# Altium project Connection_board.PrjPcb
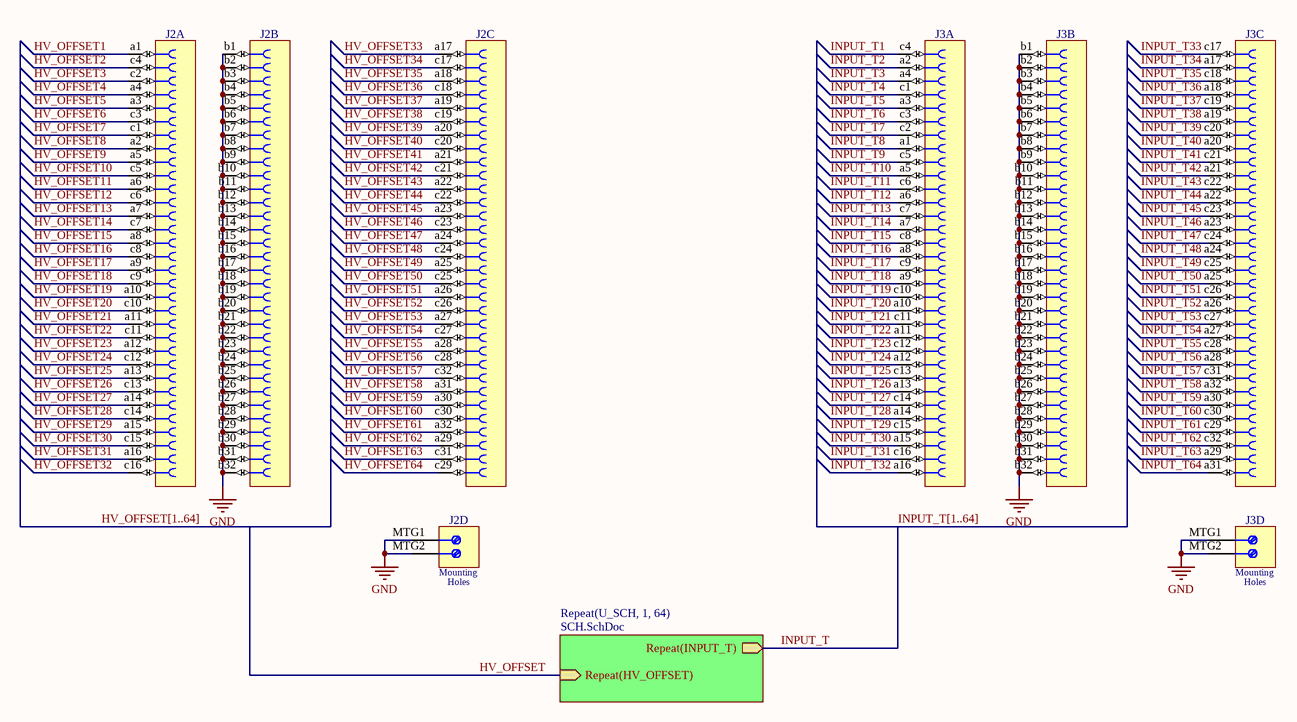
[diagram p0: Main.SchDoc]
2 sheets, 258 parts. Net scope: hierarchical (ports join the sheet entries above them; power ports are global).
Board file: PCB.PcbDoc
Sheets:
  Main.SchDoc
    U_SCH1 = SCH.SchDoc
    U_SCH2 = SCH.SchDoc
    U_SCH3 = SCH.SchDoc
    U_SCH4 = SCH.SchDoc
    U_SCH5 = SCH.SchDoc
    U_SCH6 = SCH.SchDoc
    U_SCH7 = SCH.SchDoc
    U_SCH8 = SCH.SchDoc
    U_SCH9 = SCH.SchDoc
    U_SCH10 = SCH.SchDoc
    U_SCH11 = SCH.SchDoc
    U_SCH12 = SCH.SchDoc
    U_SCH13 = SCH.SchDoc
    U_SCH14 = SCH.SchDoc
    U_SCH15 = SCH.SchDoc
    U_SCH16 = SCH.SchDoc
    U_SCH17 = SCH.SchDoc
    U_SCH18 = SCH.SchDoc
    U_SCH19 = SCH.SchDoc
    U_SCH20 = SCH.SchDoc
    U_SCH21 = SCH.SchDoc
    U_SCH22 = SCH.SchDoc
    U_SCH23 = SCH.SchDoc
    U_SCH24 = SCH.SchDoc
    U_SCH25 = SCH.SchDoc
    U_SCH26 = SCH.SchDoc
    U_SCH27 = SCH.SchDoc
    U_SCH28 = SCH.SchDoc
    U_SCH29 = SCH.SchDoc
    U_SCH30 = SCH.SchDoc
    U_SCH31 = SCH.SchDoc
    U_SCH32 = SCH.SchDoc
    U_SCH33 = SCH.SchDoc
    U_SCH34 = SCH.SchDoc
    U_SCH35 = SCH.SchDoc
    U_SCH36 = SCH.SchDoc
    U_SCH37 = SCH.SchDoc
    U_SCH38 = SCH.SchDoc
    U_SCH39 = SCH.SchDoc
    U_SCH40 = SCH.SchDoc
    U_SCH41 = SCH.SchDoc
    U_SCH42 = SCH.SchDoc
    U_SCH43 = SCH.SchDoc
    U_SCH44 = SCH.SchDoc
    U_SCH45 = SCH.SchDoc
    U_SCH46 = SCH.SchDoc
    U_SCH47 = SCH.SchDoc
    U_SCH48 = SCH.SchDoc
    U_SCH49 = SCH.SchDoc
    U_SCH50 = SCH.SchDoc
    U_SCH51 = SCH.SchDoc
    U_SCH52 = SCH.SchDoc
    U_SCH53 = SCH.SchDoc
    U_SCH54 = SCH.SchDoc
    U_SCH55 = SCH.SchDoc
    U_SCH56 = SCH.SchDoc
    U_SCH57 = SCH.SchDoc
    U_SCH58 = SCH.SchDoc
    U_SCH59 = SCH.SchDoc
    U_SCH60 = SCH.SchDoc
    U_SCH61 = SCH.SchDoc
    U_SCH62 = SCH.SchDoc
    U_SCH63 = SCH.SchDoc
    U_SCH64 = SCH.SchDoc

## Sheet Main.SchDoc
size A4

### Parts
J2  DIN 41612 Type C  [HARTING_09 03 296 6861]  (value not drawn)  (parts A,B,C,D of 4)
J3  DIN 41612 Type C  [HARTING_09 03 296 6861]  (value not drawn)  (parts A,B,C,D of 4)

### Sub-sheets
Repeat(U_SCH, 1, 64) = SCH.SchDoc: Repeat(INPUT_T) (out), Repeat(HV_OFFSET) (in)

### Nets
GND: J2.b1 J2.b2 J2.b3 J2.b4 J2.b5 J2.b6 J2.b7 J2.b8 J2.b9 J2.b10 J2.b11 J2.b12 J2.b13 J2.b14 J2.b15 J2.b16 J2.b17 J2.b18 J2.b19 J2.b20 J2.b21 J2.b22 J2.b23 J2.b24 J2.b25 J2.b26 J2.b27 J2.b28 J2.b29 J2.b30 J2.b31 J2.b32 J2.MTG1 J2.MTG2 J3.b1 J3.b2 J3.b3 J3.b4 J3.b5 J3.b6 J3.b7 J3.b8 J3.b9 J3.b10 J3.b11 J3.b12 J3.b13 J3.b14 J3.b15 J3.b16 J3.b17 J3.b18 J3.b19 J3.b20 J3.b21 J3.b22 J3.b23 J3.b24 J3.b25 J3.b26 J3.b27 J3.b28 J3.b29 J3.b30 J3.b31 J3.b32 J3.MTG1 J3.MTG2
HV_OFFSET: sheet Repeat(U_SCH, 1, 64)/Repeat(HV_OFFSET)
HV_OFFSET1: J2.a1
HV_OFFSET2: J2.c4
HV_OFFSET3: J2.c2
HV_OFFSET4: J2.a4
HV_OFFSET5: J2.a3
HV_OFFSET6: J2.c3
HV_OFFSET7: J2.c1
HV_OFFSET8: J2.a2
HV_OFFSET9: J2.a5
HV_OFFSET10: J2.c5
HV_OFFSET11: J2.a6
HV_OFFSET12: J2.c6
HV_OFFSET13: J2.a7
HV_OFFSET14: J2.c7
HV_OFFSET15: J2.a8
HV_OFFSET16: J2.c8
HV_OFFSET17: J2.a9
HV_OFFSET18: J2.c9
HV_OFFSET19: J2.a10
HV_OFFSET20: J2.c10
HV_OFFSET21: J2.a11
HV_OFFSET22: J2.c11
HV_OFFSET23: J2.a12
HV_OFFSET24: J2.c12
HV_OFFSET25: J2.a13
HV_OFFSET26: J2.c13
HV_OFFSET27: J2.a14
HV_OFFSET28: J2.c14
HV_OFFSET29: J2.a15
HV_OFFSET30: J2.c15
HV_OFFSET31: J2.a16
HV_OFFSET32: J2.c16
HV_OFFSET33: J2.a17
HV_OFFSET34: J2.c17
HV_OFFSET35: J2.a18
HV_OFFSET36: J2.c18
HV_OFFSET37: J2.a19
HV_OFFSET38: J2.c19
HV_OFFSET39: J2.a20
HV_OFFSET40: J2.c20
HV_OFFSET41: J2.a21
HV_OFFSET42: J2.c21
HV_OFFSET43: J2.a22
HV_OFFSET44: J2.c22
HV_OFFSET45: J2.a23
HV_OFFSET46: J2.c23
HV_OFFSET47: J2.a24
HV_OFFSET48: J2.c24
HV_OFFSET49: J2.a25
HV_OFFSET50: J2.c25
HV_OFFSET51: J2.a26
HV_OFFSET52: J2.c26
HV_OFFSET53: J2.a27
HV_OFFSET54: J2.c27
HV_OFFSET55: J2.a28
HV_OFFSET56: J2.c28
HV_OFFSET57: J2.c32
HV_OFFSET58: J2.a31
HV_OFFSET59: J2.a30
HV_OFFSET60: J2.c30
HV_OFFSET61: J2.a32
HV_OFFSET62: J2.a29
HV_OFFSET63: J2.c31
HV_OFFSET64: J2.c29
INPUT_T: sheet Repeat(U_SCH, 1, 64)/Repeat(INPUT_T)
INPUT_T1: J3.c4
INPUT_T2: J3.a2
INPUT_T3: J3.a4
INPUT_T4: J3.c1
INPUT_T5: J3.a3
INPUT_T6: J3.c3
INPUT_T7: J3.c2
INPUT_T8: J3.a1
INPUT_T9: J3.c5
INPUT_T10: J3.a5
INPUT_T11: J3.c6
INPUT_T12: J3.a6
INPUT_T13: J3.c7
INPUT_T14: J3.a7
INPUT_T15: J3.c8
INPUT_T16: J3.a8
INPUT_T17: J3.c9
INPUT_T18: J3.a9
INPUT_T19: J3.c10
INPUT_T20: J3.a10
INPUT_T21: J3.c11
INPUT_T22: J3.a11
INPUT_T23: J3.c12
INPUT_T24: J3.a12
INPUT_T25: J3.c13
INPUT_T26: J3.a13
INPUT_T27: J3.c14
INPUT_T28: J3.a14
INPUT_T29: J3.c15
INPUT_T30: J3.a15
INPUT_T31: J3.c16
INPUT_T32: J3.a16
INPUT_T33: J3.c17
INPUT_T34: J3.a17
INPUT_T35: J3.c18
INPUT_T36: J3.a18
INPUT_T37: J3.c19
INPUT_T38: J3.a19
INPUT_T39: J3.c20
INPUT_T40: J3.a20
INPUT_T41: J3.c21
INPUT_T42: J3.a21
INPUT_T43: J3.c22
INPUT_T44: J3.a22
INPUT_T45: J3.c23
INPUT_T46: J3.a23
INPUT_T47: J3.c24
INPUT_T48: J3.a24
INPUT_T49: J3.c25
INPUT_T50: J3.a25
INPUT_T51: J3.c26
INPUT_T52: J3.a26
INPUT_T53: J3.c27
INPUT_T54: J3.a27
INPUT_T55: J3.c28
INPUT_T56: J3.a28
INPUT_T57: J3.c31
INPUT_T58: J3.a32
INPUT_T59: J3.a30
INPUT_T60: J3.c30
INPUT_T61: J3.c29
INPUT_T62: J3.c32
INPUT_T63: J3.a29
INPUT_T64: J3.a31

### Buses and harness runs
bus HV_OFFSET[1..64]
bus INPUT_T[1..64]

### Notes on the sheet
- (in symbol HARTING_09 03 296 6861, part D) Mounting; Holes

### Library data of the parts
J2 J3 = HARTING_09 03 296 6861: Connector 96abc Female (3x32); Part Description: DIN 41612, Type C, 96 Position, Rows a+b+c, Performance level 2, Press-in Lead Lead 13mm, Pitch 2.54mm, Straight Female Connector; Part Number: HARTING_09 03 296 6861; Component Kind: Standard; Component Type: Standard; Pin Count: 98; Family: DIN 41612 Type C; Mounted: Yes; Socket: No; SMD: No; PressFit: Yes; Sense: No; Status: None; Manufacturer: HARTING; Manufacturer Part Number: 09 03 296 6861; ComponentHeight: 11.6mm; HelpURL: \\cern.ch\dfs\Applications\Altium\Datasheets\HARTING_09 03 296 6861.pdf; Author: CERN DEM JLC; CreateDate: 19.12.2016; LatestRevisionDate: 19.12.2016

## Sheet SCH.SchDoc
size A4
Used 64 times, as channels U_SCH1, U_SCH2, U_SCH3, U_SCH4, U_SCH5, U_SCH6, U_SCH7, U_SCH8, U_SCH9, U_SCH10, U_SCH11, U_SCH12, U_SCH13, U_SCH14, U_SCH15, U_SCH16, U_SCH17, U_SCH18, U_SCH19, U_SCH20, U_SCH21, U_SCH22, U_SCH23, U_SCH24, U_SCH25, U_SCH26, U_SCH27, U_SCH28, U_SCH29, U_SCH30, U_SCH31, U_SCH32, U_SCH33, U_SCH34, U_SCH35, U_SCH36, U_SCH37, U_SCH38, U_SCH39, U_SCH40, U_SCH41, U_SCH42, U_SCH43, U_SCH44, U_SCH45, U_SCH46, U_SCH47, U_SCH48, U_SCH49, U_SCH50, U_SCH51, U_SCH52, U_SCH53, U_SCH54, U_SCH55, U_SCH56, U_SCH57, U_SCH58, U_SCH59, U_SCH60, U_SCH61, U_SCH62, U_SCH63, U_SCH64. Parts and nets are listed once, with the designators drawn on the sheet.
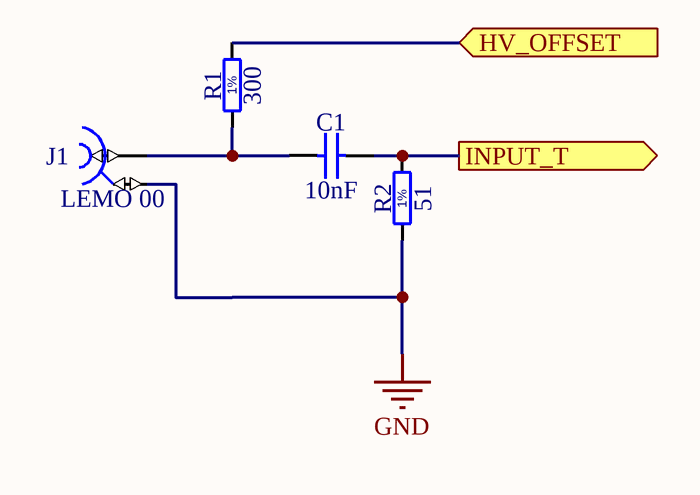
[diagram p1: SCH.SchDoc]

### Parts
C1  10nF  [CAPC2012X135N]
J1  LEMO 00  [LEMO_EPA.00.250.NTN]
R1  300  [RESC2012X60N]
R2  51  [RESC2012X60N]

### Ports
HV_OFFSET (in), INPUT_T (out)

### Nets
GND: J1.2 R2.1
HV_OFFSET: R1.2 ; port HV_OFFSET
INPUT_T: C1.2 R2.2 ; port INPUT_T
NetC1_1: C1.1 J1.1 R1.1

### Channels
U_SCH1: designators end in _U_SCH1; ports HV_OFFSET=HV_OFFSET1 INPUT_T=INPUT_T1
U_SCH2: designators end in _U_SCH2; ports HV_OFFSET=HV_OFFSET2 INPUT_T=INPUT_T2
U_SCH3: designators end in _U_SCH3; ports HV_OFFSET=HV_OFFSET3 INPUT_T=INPUT_T3
U_SCH4: designators end in _U_SCH4; ports HV_OFFSET=HV_OFFSET4 INPUT_T=INPUT_T4
U_SCH5: designators end in _U_SCH5; ports HV_OFFSET=HV_OFFSET5 INPUT_T=INPUT_T5
U_SCH6: designators end in _U_SCH6; ports HV_OFFSET=HV_OFFSET6 INPUT_T=INPUT_T6
U_SCH7: designators end in _U_SCH7; ports HV_OFFSET=HV_OFFSET7 INPUT_T=INPUT_T7
U_SCH8: designators end in _U_SCH8; ports HV_OFFSET=HV_OFFSET8 INPUT_T=INPUT_T8
U_SCH9: designators end in _U_SCH9; ports HV_OFFSET=HV_OFFSET9 INPUT_T=INPUT_T9
U_SCH10: designators end in _U_SCH10; ports HV_OFFSET=HV_OFFSET10 INPUT_T=INPUT_T10
U_SCH11: designators end in _U_SCH11; ports HV_OFFSET=HV_OFFSET11 INPUT_T=INPUT_T11
U_SCH12: designators end in _U_SCH12; ports HV_OFFSET=HV_OFFSET12 INPUT_T=INPUT_T12
U_SCH13: designators end in _U_SCH13; ports HV_OFFSET=HV_OFFSET13 INPUT_T=INPUT_T13
U_SCH14: designators end in _U_SCH14; ports HV_OFFSET=HV_OFFSET14 INPUT_T=INPUT_T14
U_SCH15: designators end in _U_SCH15; ports HV_OFFSET=HV_OFFSET15 INPUT_T=INPUT_T15
U_SCH16: designators end in _U_SCH16; ports HV_OFFSET=HV_OFFSET16 INPUT_T=INPUT_T16
U_SCH17: designators end in _U_SCH17; ports HV_OFFSET=HV_OFFSET17 INPUT_T=INPUT_T17
U_SCH18: designators end in _U_SCH18; ports HV_OFFSET=HV_OFFSET18 INPUT_T=INPUT_T18
U_SCH19: designators end in _U_SCH19; ports HV_OFFSET=HV_OFFSET19 INPUT_T=INPUT_T19
U_SCH20: designators end in _U_SCH20; ports HV_OFFSET=HV_OFFSET20 INPUT_T=INPUT_T20
U_SCH21: designators end in _U_SCH21; ports HV_OFFSET=HV_OFFSET21 INPUT_T=INPUT_T21
U_SCH22: designators end in _U_SCH22; ports HV_OFFSET=HV_OFFSET22 INPUT_T=INPUT_T22
U_SCH23: designators end in _U_SCH23; ports HV_OFFSET=HV_OFFSET23 INPUT_T=INPUT_T23
U_SCH24: designators end in _U_SCH24; ports HV_OFFSET=HV_OFFSET24 INPUT_T=INPUT_T24
U_SCH25: designators end in _U_SCH25; ports HV_OFFSET=HV_OFFSET25 INPUT_T=INPUT_T25
U_SCH26: designators end in _U_SCH26; ports HV_OFFSET=HV_OFFSET26 INPUT_T=INPUT_T26
U_SCH27: designators end in _U_SCH27; ports HV_OFFSET=HV_OFFSET27 INPUT_T=INPUT_T27
U_SCH28: designators end in _U_SCH28; ports HV_OFFSET=HV_OFFSET28 INPUT_T=INPUT_T28
U_SCH29: designators end in _U_SCH29; ports HV_OFFSET=HV_OFFSET29 INPUT_T=INPUT_T29
U_SCH30: designators end in _U_SCH30; ports HV_OFFSET=HV_OFFSET30 INPUT_T=INPUT_T30
U_SCH31: designators end in _U_SCH31; ports HV_OFFSET=HV_OFFSET31 INPUT_T=INPUT_T31
U_SCH32: designators end in _U_SCH32; ports HV_OFFSET=HV_OFFSET32 INPUT_T=INPUT_T32
U_SCH33: designators end in _U_SCH33; ports HV_OFFSET=HV_OFFSET33 INPUT_T=INPUT_T33
U_SCH34: designators end in _U_SCH34; ports HV_OFFSET=HV_OFFSET34 INPUT_T=INPUT_T34
U_SCH35: designators end in _U_SCH35; ports HV_OFFSET=HV_OFFSET35 INPUT_T=INPUT_T35
U_SCH36: designators end in _U_SCH36; ports HV_OFFSET=HV_OFFSET36 INPUT_T=INPUT_T36
U_SCH37: designators end in _U_SCH37; ports HV_OFFSET=HV_OFFSET37 INPUT_T=INPUT_T37
U_SCH38: designators end in _U_SCH38; ports HV_OFFSET=HV_OFFSET38 INPUT_T=INPUT_T38
U_SCH39: designators end in _U_SCH39; ports HV_OFFSET=HV_OFFSET39 INPUT_T=INPUT_T39
U_SCH40: designators end in _U_SCH40; ports HV_OFFSET=HV_OFFSET40 INPUT_T=INPUT_T40
U_SCH41: designators end in _U_SCH41; ports HV_OFFSET=HV_OFFSET41 INPUT_T=INPUT_T41
U_SCH42: designators end in _U_SCH42; ports HV_OFFSET=HV_OFFSET42 INPUT_T=INPUT_T42
U_SCH43: designators end in _U_SCH43; ports HV_OFFSET=HV_OFFSET43 INPUT_T=INPUT_T43
U_SCH44: designators end in _U_SCH44; ports HV_OFFSET=HV_OFFSET44 INPUT_T=INPUT_T44
U_SCH45: designators end in _U_SCH45; ports HV_OFFSET=HV_OFFSET45 INPUT_T=INPUT_T45
U_SCH46: designators end in _U_SCH46; ports HV_OFFSET=HV_OFFSET46 INPUT_T=INPUT_T46
U_SCH47: designators end in _U_SCH47; ports HV_OFFSET=HV_OFFSET47 INPUT_T=INPUT_T47
U_SCH48: designators end in _U_SCH48; ports HV_OFFSET=HV_OFFSET48 INPUT_T=INPUT_T48
U_SCH49: designators end in _U_SCH49; ports HV_OFFSET=HV_OFFSET49 INPUT_T=INPUT_T49
U_SCH50: designators end in _U_SCH50; ports HV_OFFSET=HV_OFFSET50 INPUT_T=INPUT_T50
U_SCH51: designators end in _U_SCH51; ports HV_OFFSET=HV_OFFSET51 INPUT_T=INPUT_T51
U_SCH52: designators end in _U_SCH52; ports HV_OFFSET=HV_OFFSET52 INPUT_T=INPUT_T52
U_SCH53: designators end in _U_SCH53; ports HV_OFFSET=HV_OFFSET53 INPUT_T=INPUT_T53
U_SCH54: designators end in _U_SCH54; ports HV_OFFSET=HV_OFFSET54 INPUT_T=INPUT_T54
U_SCH55: designators end in _U_SCH55; ports HV_OFFSET=HV_OFFSET55 INPUT_T=INPUT_T55
U_SCH56: designators end in _U_SCH56; ports HV_OFFSET=HV_OFFSET56 INPUT_T=INPUT_T56
U_SCH57: designators end in _U_SCH57; ports HV_OFFSET=HV_OFFSET57 INPUT_T=INPUT_T57
U_SCH58: designators end in _U_SCH58; ports HV_OFFSET=HV_OFFSET58 INPUT_T=INPUT_T58
U_SCH59: designators end in _U_SCH59; ports HV_OFFSET=HV_OFFSET59 INPUT_T=INPUT_T59
U_SCH60: designators end in _U_SCH60; ports HV_OFFSET=HV_OFFSET60 INPUT_T=INPUT_T60
U_SCH61: designators end in _U_SCH61; ports HV_OFFSET=HV_OFFSET61 INPUT_T=INPUT_T61
U_SCH62: designators end in _U_SCH62; ports HV_OFFSET=HV_OFFSET62 INPUT_T=INPUT_T62
U_SCH63: designators end in _U_SCH63; ports HV_OFFSET=HV_OFFSET63 INPUT_T=INPUT_T63
U_SCH64: designators end in _U_SCH64; ports HV_OFFSET=HV_OFFSET64 INPUT_T=INPUT_T64

### Notes on the sheet
- (in symbol R0805_51R_1%_0.125W_100PPM) 1%
- (in symbol R0805_300R_1%_0.125W_100PPM) 1%

### Library data of the parts
C1 = CC0805_10NF_50V_10%_X7R: Non-polarised capacitor; Part Description: SMD Multilayer Chip Ceramic Capacitor; Manufacturer: GENERIC; Manufacturer1 Part Number: C0805C103K5RACTU; Voltage: 50V; TC: X7R; Tolerance: ±10%; Part Number: CC0805_10NF_50V_10%_X7R; Component Kind: Standard; Component Type: Standard; Pin Count: 2; Value: 10nF; Status: Preferred; Manufacturer Part Number: CC0805_10NF_50V_10%_X7R; Case: 0805; Mounted: Yes; Socket: No; SMD: Yes; Sense: No; Manufacturer1 Example: KEMET; Manufacturer1 ComponentHeight: 0.88mm; HelpURL: \\cern.ch\dfs\Applications\Altium\Datasheets\CC0805_X7R_KEMET.pdf; Author: CERN DEM JLC; CreateDate: 03.12.2007; LatestRevisionDate: 22.04.2015
J1 = LEMO_EPA.00.250.NTN: Part Description: Size 00, 50 Ohms Coaxial Straight socket; PressFit: No; SCEM: 09.46.11.184.2; Part Number: LEMO_EPA.00.250.NTN; Component Kind: Standard; Component Type: Standard; Pin Count: 2; Family: LEMO 00; Mounted: Yes; Socket: No; SMD: No; Sense: No; Status: None; Manufacturer: LEMO; Manufacturer Part Number: EPA.00.250.NTN; ComponentHeight: 14mm; HelpURL: \\cern.ch\dfs\Applications\Altium\Datasheets\LEMO_EPA.00.250.NTN.pdf; Author: CERN DEM JLC; CreateDate: 22.04.2008; LatestRevisionDate: 22.04.2008
R1 = R0805_300R_1%_0.125W_100PPM: Resistor - 1%; Part Description: General Purpose Thick Film Chip Resistor; Manufacturer: GENERIC; Manufacturer1 Part Number: NRC10F3000TRF; Power: 0.125W; TC: ±100ppm/°C; PressFit: No; Part Number: R0805_300R_1%_0.125W_100PPM; Component Kind: Standard; Component Type: Standard; Pin Count: 2; Value: 300; Status: Preferred; Tolerance: ±1%; Manufacturer Part Number: R0805_300R_1%_0.125W_100PPM; Case: 0805; Mounted: Yes; Sense: No; Socket: No; SMD: Yes; Manufacturer1 Example: NIC COMPONENT; Manufacturer1 ComponentHeight: 0.6mm; HelpURL: \\cern.ch\dfs\Applications\Altium\Datasheets\R0805_NIC_NRC.pdf; Author: CERN DEM JLC; CreateDate: 03.12.2007; LatestRevisionDate: 13.03.2008
R2 = R0805_51R_1%_0.125W_100PPM: Resistor - 1%; Part Description: General Purpose Thick Film Chip Resistor; Manufacturer: GENERIC; Manufacturer1 Part Number: NRC10F51R0TRF; Power: 0.125W; TC: ±100ppm/°C; PressFit: No; Part Number: R0805_51R_1%_0.125W_100PPM; Component Kind: Standard; Component Type: Standard; Pin Count: 2; Value: 51; Status: Preferred; Tolerance: ±1%; Manufacturer Part Number: R0805_51R_1%_0.125W_100PPM; Case: 0805; Mounted: Yes; Sense: No; Socket: No; SMD: Yes; Manufacturer1 Example: NIC COMPONENT; Manufacturer1 ComponentHeight: 0.6mm; HelpURL: \\cern.ch\dfs\Applications\Altium\Datasheets\R0805_NIC_NRC.pdf; Author: CERN DEM JLC; CreateDate: 03.12.2007; LatestRevisionDate: 13.03.2008

## Nets that join several sheets
GND: Main (68 pins), U_SCH1 (J1_U_SCH1.2 R2_U_SCH1.1), U_SCH2 (J1_U_SCH2.2 R2_U_SCH2.1), U_SCH3 (J1_U_SCH3.2 R2_U_SCH3.1), U_SCH4 (J1_U_SCH4.2 R2_U_SCH4.1), U_SCH5 (J1_U_SCH5.2 R2_U_SCH5.1), U_SCH6 (J1_U_SCH6.2 R2_U_SCH6.1), U_SCH7 (J1_U_SCH7.2 R2_U_SCH7.1), U_SCH8 (J1_U_SCH8.2 R2_U_SCH8.1), U_SCH9 (J1_U_SCH9.2 R2_U_SCH9.1), U_SCH10 (J1_U_SCH10.2 R2_U_SCH10.1), U_SCH11 (J1_U_SCH11.2 R2_U_SCH11.1), U_SCH12 (J1_U_SCH12.2 R2_U_SCH12.1), U_SCH13 (J1_U_SCH13.2 R2_U_SCH13.1), U_SCH14 (J1_U_SCH14.2 R2_U_SCH14.1), U_SCH15 (J1_U_SCH15.2 R2_U_SCH15.1), U_SCH16 (J1_U_SCH16.2 R2_U_SCH16.1), U_SCH17 (J1_U_SCH17.2 R2_U_SCH17.1), U_SCH18 (J1_U_SCH18.2 R2_U_SCH18.1), U_SCH19 (J1_U_SCH19.2 R2_U_SCH19.1), U_SCH20 (J1_U_SCH20.2 R2_U_SCH20.1), U_SCH21 (J1_U_SCH21.2 R2_U_SCH21.1), U_SCH22 (J1_U_SCH22.2 R2_U_SCH22.1), U_SCH23 (J1_U_SCH23.2 R2_U_SCH23.1), U_SCH24 (J1_U_SCH24.2 R2_U_SCH24.1), U_SCH25 (J1_U_SCH25.2 R2_U_SCH25.1), U_SCH26 (J1_U_SCH26.2 R2_U_SCH26.1), U_SCH27 (J1_U_SCH27.2 R2_U_SCH27.1), U_SCH28 (J1_U_SCH28.2 R2_U_SCH28.1), U_SCH29 (J1_U_SCH29.2 R2_U_SCH29.1), U_SCH30 (J1_U_SCH30.2 R2_U_SCH30.1), U_SCH31 (J1_U_SCH31.2 R2_U_SCH31.1), U_SCH32 (J1_U_SCH32.2 R2_U_SCH32.1), U_SCH33 (J1_U_SCH33.2 R2_U_SCH33.1), U_SCH34 (J1_U_SCH34.2 R2_U_SCH34.1), U_SCH35 (J1_U_SCH35.2 R2_U_SCH35.1), U_SCH36 (J1_U_SCH36.2 R2_U_SCH36.1), U_SCH37 (J1_U_SCH37.2 R2_U_SCH37.1), U_SCH38 (J1_U_SCH38.2 R2_U_SCH38.1), U_SCH39 (J1_U_SCH39.2 R2_U_SCH39.1), U_SCH40 (J1_U_SCH40.2 R2_U_SCH40.1), U_SCH41 (J1_U_SCH41.2 R2_U_SCH41.1), U_SCH42 (J1_U_SCH42.2 R2_U_SCH42.1), U_SCH43 (J1_U_SCH43.2 R2_U_SCH43.1), U_SCH44 (J1_U_SCH44.2 R2_U_SCH44.1), U_SCH45 (J1_U_SCH45.2 R2_U_SCH45.1), U_SCH46 (J1_U_SCH46.2 R2_U_SCH46.1), U_SCH47 (J1_U_SCH47.2 R2_U_SCH47.1), U_SCH48 (J1_U_SCH48.2 R2_U_SCH48.1), U_SCH49 (J1_U_SCH49.2 R2_U_SCH49.1), U_SCH50 (J1_U_SCH50.2 R2_U_SCH50.1), U_SCH51 (J1_U_SCH51.2 R2_U_SCH51.1), U_SCH52 (J1_U_SCH52.2 R2_U_SCH52.1), U_SCH53 (J1_U_SCH53.2 R2_U_SCH53.1), U_SCH54 (J1_U_SCH54.2 R2_U_SCH54.1), U_SCH55 (J1_U_SCH55.2 R2_U_SCH55.1), U_SCH56 (J1_U_SCH56.2 R2_U_SCH56.1), U_SCH57 (J1_U_SCH57.2 R2_U_SCH57.1), U_SCH58 (J1_U_SCH58.2 R2_U_SCH58.1), U_SCH59 (J1_U_SCH59.2 R2_U_SCH59.1), U_SCH60 (J1_U_SCH60.2 R2_U_SCH60.1), U_SCH61 (J1_U_SCH61.2 R2_U_SCH61.1), U_SCH62 (J1_U_SCH62.2 R2_U_SCH62.1), U_SCH63 (J1_U_SCH63.2 R2_U_SCH63.1), U_SCH64 (J1_U_SCH64.2 R2_U_SCH64.1)
HV_OFFSET1: Main (J2.a1), U_SCH1 (R1_U_SCH1.2)
HV_OFFSET2: Main (J2.c4), U_SCH2 (R1_U_SCH2.2)
HV_OFFSET3: Main (J2.c2), U_SCH3 (R1_U_SCH3.2)
HV_OFFSET4: Main (J2.a4), U_SCH4 (R1_U_SCH4.2)
HV_OFFSET5: Main (J2.a3), U_SCH5 (R1_U_SCH5.2)
HV_OFFSET6: Main (J2.c3), U_SCH6 (R1_U_SCH6.2)
HV_OFFSET7: Main (J2.c1), U_SCH7 (R1_U_SCH7.2)
HV_OFFSET8: Main (J2.a2), U_SCH8 (R1_U_SCH8.2)
HV_OFFSET9: Main (J2.a5), U_SCH9 (R1_U_SCH9.2)
HV_OFFSET10: Main (J2.c5), U_SCH10 (R1_U_SCH10.2)
HV_OFFSET11: Main (J2.a6), U_SCH11 (R1_U_SCH11.2)
HV_OFFSET12: Main (J2.c6), U_SCH12 (R1_U_SCH12.2)
HV_OFFSET13: Main (J2.a7), U_SCH13 (R1_U_SCH13.2)
HV_OFFSET14: Main (J2.c7), U_SCH14 (R1_U_SCH14.2)
HV_OFFSET15: Main (J2.a8), U_SCH15 (R1_U_SCH15.2)
HV_OFFSET16: Main (J2.c8), U_SCH16 (R1_U_SCH16.2)
HV_OFFSET17: Main (J2.a9), U_SCH17 (R1_U_SCH17.2)
HV_OFFSET18: Main (J2.c9), U_SCH18 (R1_U_SCH18.2)
HV_OFFSET19: Main (J2.a10), U_SCH19 (R1_U_SCH19.2)
HV_OFFSET20: Main (J2.c10), U_SCH20 (R1_U_SCH20.2)
HV_OFFSET21: Main (J2.a11), U_SCH21 (R1_U_SCH21.2)
HV_OFFSET22: Main (J2.c11), U_SCH22 (R1_U_SCH22.2)
HV_OFFSET23: Main (J2.a12), U_SCH23 (R1_U_SCH23.2)
HV_OFFSET24: Main (J2.c12), U_SCH24 (R1_U_SCH24.2)
HV_OFFSET25: Main (J2.a13), U_SCH25 (R1_U_SCH25.2)
HV_OFFSET26: Main (J2.c13), U_SCH26 (R1_U_SCH26.2)
HV_OFFSET27: Main (J2.a14), U_SCH27 (R1_U_SCH27.2)
HV_OFFSET28: Main (J2.c14), U_SCH28 (R1_U_SCH28.2)
HV_OFFSET29: Main (J2.a15), U_SCH29 (R1_U_SCH29.2)
HV_OFFSET30: Main (J2.c15), U_SCH30 (R1_U_SCH30.2)
HV_OFFSET31: Main (J2.a16), U_SCH31 (R1_U_SCH31.2)
HV_OFFSET32: Main (J2.c16), U_SCH32 (R1_U_SCH32.2)
HV_OFFSET33: Main (J2.a17), U_SCH33 (R1_U_SCH33.2)
HV_OFFSET34: Main (J2.c17), U_SCH34 (R1_U_SCH34.2)
HV_OFFSET35: Main (J2.a18), U_SCH35 (R1_U_SCH35.2)
HV_OFFSET36: Main (J2.c18), U_SCH36 (R1_U_SCH36.2)
HV_OFFSET37: Main (J2.a19), U_SCH37 (R1_U_SCH37.2)
HV_OFFSET38: Main (J2.c19), U_SCH38 (R1_U_SCH38.2)
HV_OFFSET39: Main (J2.a20), U_SCH39 (R1_U_SCH39.2)
HV_OFFSET40: Main (J2.c20), U_SCH40 (R1_U_SCH40.2)
HV_OFFSET41: Main (J2.a21), U_SCH41 (R1_U_SCH41.2)
HV_OFFSET42: Main (J2.c21), U_SCH42 (R1_U_SCH42.2)
HV_OFFSET43: Main (J2.a22), U_SCH43 (R1_U_SCH43.2)
HV_OFFSET44: Main (J2.c22), U_SCH44 (R1_U_SCH44.2)
HV_OFFSET45: Main (J2.a23), U_SCH45 (R1_U_SCH45.2)
HV_OFFSET46: Main (J2.c23), U_SCH46 (R1_U_SCH46.2)
HV_OFFSET47: Main (J2.a24), U_SCH47 (R1_U_SCH47.2)
HV_OFFSET48: Main (J2.c24), U_SCH48 (R1_U_SCH48.2)
HV_OFFSET49: Main (J2.a25), U_SCH49 (R1_U_SCH49.2)
HV_OFFSET50: Main (J2.c25), U_SCH50 (R1_U_SCH50.2)
HV_OFFSET51: Main (J2.a26), U_SCH51 (R1_U_SCH51.2)
HV_OFFSET52: Main (J2.c26), U_SCH52 (R1_U_SCH52.2)
HV_OFFSET53: Main (J2.a27), U_SCH53 (R1_U_SCH53.2)
HV_OFFSET54: Main (J2.c27), U_SCH54 (R1_U_SCH54.2)
HV_OFFSET55: Main (J2.a28), U_SCH55 (R1_U_SCH55.2)
HV_OFFSET56: Main (J2.c28), U_SCH56 (R1_U_SCH56.2)
HV_OFFSET57: Main (J2.c32), U_SCH57 (R1_U_SCH57.2)
HV_OFFSET58: Main (J2.a31), U_SCH58 (R1_U_SCH58.2)
HV_OFFSET59: Main (J2.a30), U_SCH59 (R1_U_SCH59.2)
HV_OFFSET60: Main (J2.c30), U_SCH60 (R1_U_SCH60.2)
HV_OFFSET61: Main (J2.a32), U_SCH61 (R1_U_SCH61.2)
HV_OFFSET62: Main (J2.a29), U_SCH62 (R1_U_SCH62.2)
HV_OFFSET63: Main (J2.c31), U_SCH63 (R1_U_SCH63.2)
HV_OFFSET64: Main (J2.c29), U_SCH64 (R1_U_SCH64.2)
INPUT_T1: Main (J3.c4), U_SCH1 (C1_U_SCH1.2 R2_U_SCH1.2)
INPUT_T2: Main (J3.a2), U_SCH2 (C1_U_SCH2.2 R2_U_SCH2.2)
INPUT_T3: Main (J3.a4), U_SCH3 (C1_U_SCH3.2 R2_U_SCH3.2)
INPUT_T4: Main (J3.c1), U_SCH4 (C1_U_SCH4.2 R2_U_SCH4.2)
INPUT_T5: Main (J3.a3), U_SCH5 (C1_U_SCH5.2 R2_U_SCH5.2)
INPUT_T6: Main (J3.c3), U_SCH6 (C1_U_SCH6.2 R2_U_SCH6.2)
INPUT_T7: Main (J3.c2), U_SCH7 (C1_U_SCH7.2 R2_U_SCH7.2)
INPUT_T8: Main (J3.a1), U_SCH8 (C1_U_SCH8.2 R2_U_SCH8.2)
INPUT_T9: Main (J3.c5), U_SCH9 (C1_U_SCH9.2 R2_U_SCH9.2)
INPUT_T10: Main (J3.a5), U_SCH10 (C1_U_SCH10.2 R2_U_SCH10.2)
INPUT_T11: Main (J3.c6), U_SCH11 (C1_U_SCH11.2 R2_U_SCH11.2)
INPUT_T12: Main (J3.a6), U_SCH12 (C1_U_SCH12.2 R2_U_SCH12.2)
INPUT_T13: Main (J3.c7), U_SCH13 (C1_U_SCH13.2 R2_U_SCH13.2)
INPUT_T14: Main (J3.a7), U_SCH14 (C1_U_SCH14.2 R2_U_SCH14.2)
INPUT_T15: Main (J3.c8), U_SCH15 (C1_U_SCH15.2 R2_U_SCH15.2)
INPUT_T16: Main (J3.a8), U_SCH16 (C1_U_SCH16.2 R2_U_SCH16.2)
INPUT_T17: Main (J3.c9), U_SCH17 (C1_U_SCH17.2 R2_U_SCH17.2)
INPUT_T18: Main (J3.a9), U_SCH18 (C1_U_SCH18.2 R2_U_SCH18.2)
INPUT_T19: Main (J3.c10), U_SCH19 (C1_U_SCH19.2 R2_U_SCH19.2)
INPUT_T20: Main (J3.a10), U_SCH20 (C1_U_SCH20.2 R2_U_SCH20.2)
INPUT_T21: Main (J3.c11), U_SCH21 (C1_U_SCH21.2 R2_U_SCH21.2)
INPUT_T22: Main (J3.a11), U_SCH22 (C1_U_SCH22.2 R2_U_SCH22.2)
INPUT_T23: Main (J3.c12), U_SCH23 (C1_U_SCH23.2 R2_U_SCH23.2)
INPUT_T24: Main (J3.a12), U_SCH24 (C1_U_SCH24.2 R2_U_SCH24.2)
INPUT_T25: Main (J3.c13), U_SCH25 (C1_U_SCH25.2 R2_U_SCH25.2)
INPUT_T26: Main (J3.a13), U_SCH26 (C1_U_SCH26.2 R2_U_SCH26.2)
INPUT_T27: Main (J3.c14), U_SCH27 (C1_U_SCH27.2 R2_U_SCH27.2)
INPUT_T28: Main (J3.a14), U_SCH28 (C1_U_SCH28.2 R2_U_SCH28.2)
INPUT_T29: Main (J3.c15), U_SCH29 (C1_U_SCH29.2 R2_U_SCH29.2)
INPUT_T30: Main (J3.a15), U_SCH30 (C1_U_SCH30.2 R2_U_SCH30.2)
INPUT_T31: Main (J3.c16), U_SCH31 (C1_U_SCH31.2 R2_U_SCH31.2)
INPUT_T32: Main (J3.a16), U_SCH32 (C1_U_SCH32.2 R2_U_SCH32.2)
INPUT_T33: Main (J3.c17), U_SCH33 (C1_U_SCH33.2 R2_U_SCH33.2)
INPUT_T34: Main (J3.a17), U_SCH34 (C1_U_SCH34.2 R2_U_SCH34.2)
INPUT_T35: Main (J3.c18), U_SCH35 (C1_U_SCH35.2 R2_U_SCH35.2)
INPUT_T36: Main (J3.a18), U_SCH36 (C1_U_SCH36.2 R2_U_SCH36.2)
INPUT_T37: Main (J3.c19), U_SCH37 (C1_U_SCH37.2 R2_U_SCH37.2)
INPUT_T38: Main (J3.a19), U_SCH38 (C1_U_SCH38.2 R2_U_SCH38.2)
INPUT_T39: Main (J3.c20), U_SCH39 (C1_U_SCH39.2 R2_U_SCH39.2)
INPUT_T40: Main (J3.a20), U_SCH40 (C1_U_SCH40.2 R2_U_SCH40.2)
INPUT_T41: Main (J3.c21), U_SCH41 (C1_U_SCH41.2 R2_U_SCH41.2)
INPUT_T42: Main (J3.a21), U_SCH42 (C1_U_SCH42.2 R2_U_SCH42.2)
INPUT_T43: Main (J3.c22), U_SCH43 (C1_U_SCH43.2 R2_U_SCH43.2)
INPUT_T44: Main (J3.a22), U_SCH44 (C1_U_SCH44.2 R2_U_SCH44.2)
INPUT_T45: Main (J3.c23), U_SCH45 (C1_U_SCH45.2 R2_U_SCH45.2)
INPUT_T46: Main (J3.a23), U_SCH46 (C1_U_SCH46.2 R2_U_SCH46.2)
INPUT_T47: Main (J3.c24), U_SCH47 (C1_U_SCH47.2 R2_U_SCH47.2)
INPUT_T48: Main (J3.a24), U_SCH48 (C1_U_SCH48.2 R2_U_SCH48.2)
INPUT_T49: Main (J3.c25), U_SCH49 (C1_U_SCH49.2 R2_U_SCH49.2)
INPUT_T50: Main (J3.a25), U_SCH50 (C1_U_SCH50.2 R2_U_SCH50.2)
INPUT_T51: Main (J3.c26), U_SCH51 (C1_U_SCH51.2 R2_U_SCH51.2)
INPUT_T52: Main (J3.a26), U_SCH52 (C1_U_SCH52.2 R2_U_SCH52.2)
INPUT_T53: Main (J3.c27), U_SCH53 (C1_U_SCH53.2 R2_U_SCH53.2)
INPUT_T54: Main (J3.a27), U_SCH54 (C1_U_SCH54.2 R2_U_SCH54.2)
INPUT_T55: Main (J3.c28), U_SCH55 (C1_U_SCH55.2 R2_U_SCH55.2)
INPUT_T56: Main (J3.a28), U_SCH56 (C1_U_SCH56.2 R2_U_SCH56.2)
INPUT_T57: Main (J3.c31), U_SCH57 (C1_U_SCH57.2 R2_U_SCH57.2)
INPUT_T58: Main (J3.a32), U_SCH58 (C1_U_SCH58.2 R2_U_SCH58.2)
INPUT_T59: Main (J3.a30), U_SCH59 (C1_U_SCH59.2 R2_U_SCH59.2)
INPUT_T60: Main (J3.c30), U_SCH60 (C1_U_SCH60.2 R2_U_SCH60.2)
INPUT_T61: Main (J3.c29), U_SCH61 (C1_U_SCH61.2 R2_U_SCH61.2)
INPUT_T62: Main (J3.c32), U_SCH62 (C1_U_SCH62.2 R2_U_SCH62.2)
INPUT_T63: Main (J3.a29), U_SCH63 (C1_U_SCH63.2 R2_U_SCH63.2)
INPUT_T64: Main (J3.a31), U_SCH64 (C1_U_SCH64.2 R2_U_SCH64.2)